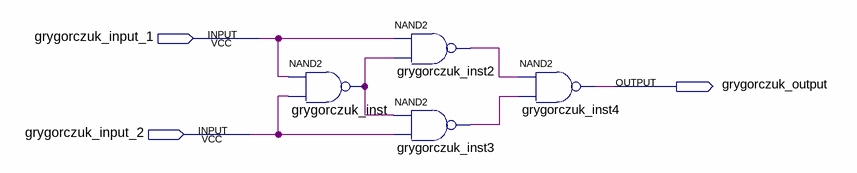
[diagram p0: schematic sheet]
// Quartus schematic XOR_GATES.bdf as structural Verilog: 4 symbols, 3 pins
module XOR_GATES (
  input  grygorczuk_input_1,
  input  grygorczuk_input_2,
  output grygorczuk_output
);

  wire grygorczuk_inst2_out, grygorczuk_inst3_out, grygorczuk_inst_out;

  nand grygorczuk_inst (grygorczuk_inst_out, grygorczuk_input_1, grygorczuk_input_2);
  nand grygorczuk_inst2 (grygorczuk_inst2_out, grygorczuk_input_1, grygorczuk_inst_out);
  nand grygorczuk_inst3 (grygorczuk_inst3_out, grygorczuk_inst_out, grygorczuk_input_2);
  nand grygorczuk_inst4 (grygorczuk_output, grygorczuk_inst2_out, grygorczuk_inst3_out);
endmodule
